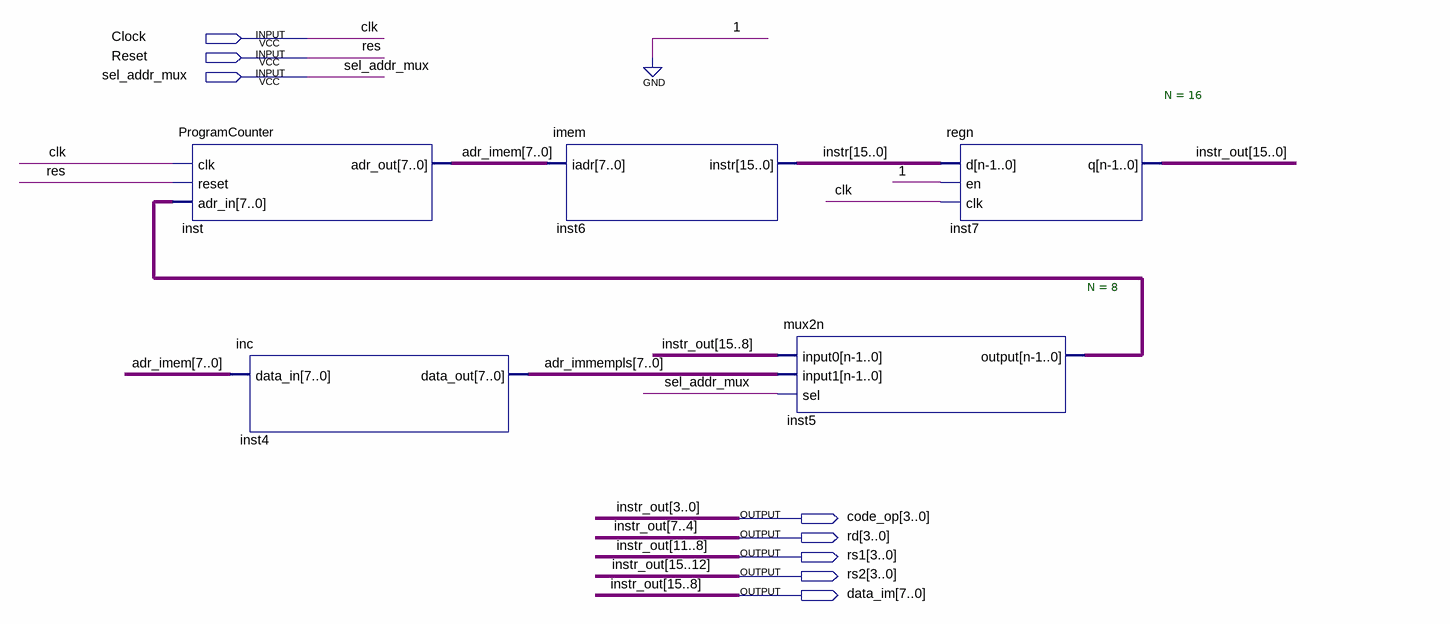
[diagram p0: schematic sheet]
// Quartus schematic IF.bdf as structural Verilog: 5 symbols, 8 pins
module IF (
  input  Clock,
  input  Reset,
  input  sel_addr_mux,
  output [3:0] code_op,
  output [3:0] rd,
  output [3:0] rs1,
  output [3:0] rs2,
  output [7:0] data_im
);

  wire [7:0] adr_imem, adr_immempls, inst5_output;
  wire [15:0] instr;

  ProgramCounter inst (.clk(Clock), .reset(Reset), .adr_in(inst5_output), .adr_out(adr_imem));
  inc inst4 (.data_in(adr_imem), .data_out(adr_immempls));
  imem inst6 (.iadr(adr_imem), .instr(instr));
  mux2n #(.N(8)) inst5 (.input0(data_im), .input1(adr_immempls), .sel(sel_addr_mux), .\output (inst5_output));
  regn #(.N(16)) inst7 (.d(instr), .en(1'b0), .clk(Clock), .q({data_im, rd, code_op}));

  assign rs1 = data_im[3:0];
  assign rs2 = data_im[7:4];

  // Other names for the same wires on the sheet: clk = Clock; instr_out[15:0] = {data_im, rd, code_op}; res = Reset
endmodule
